# EAGLE design scout_bom (EAGLE 5.07)
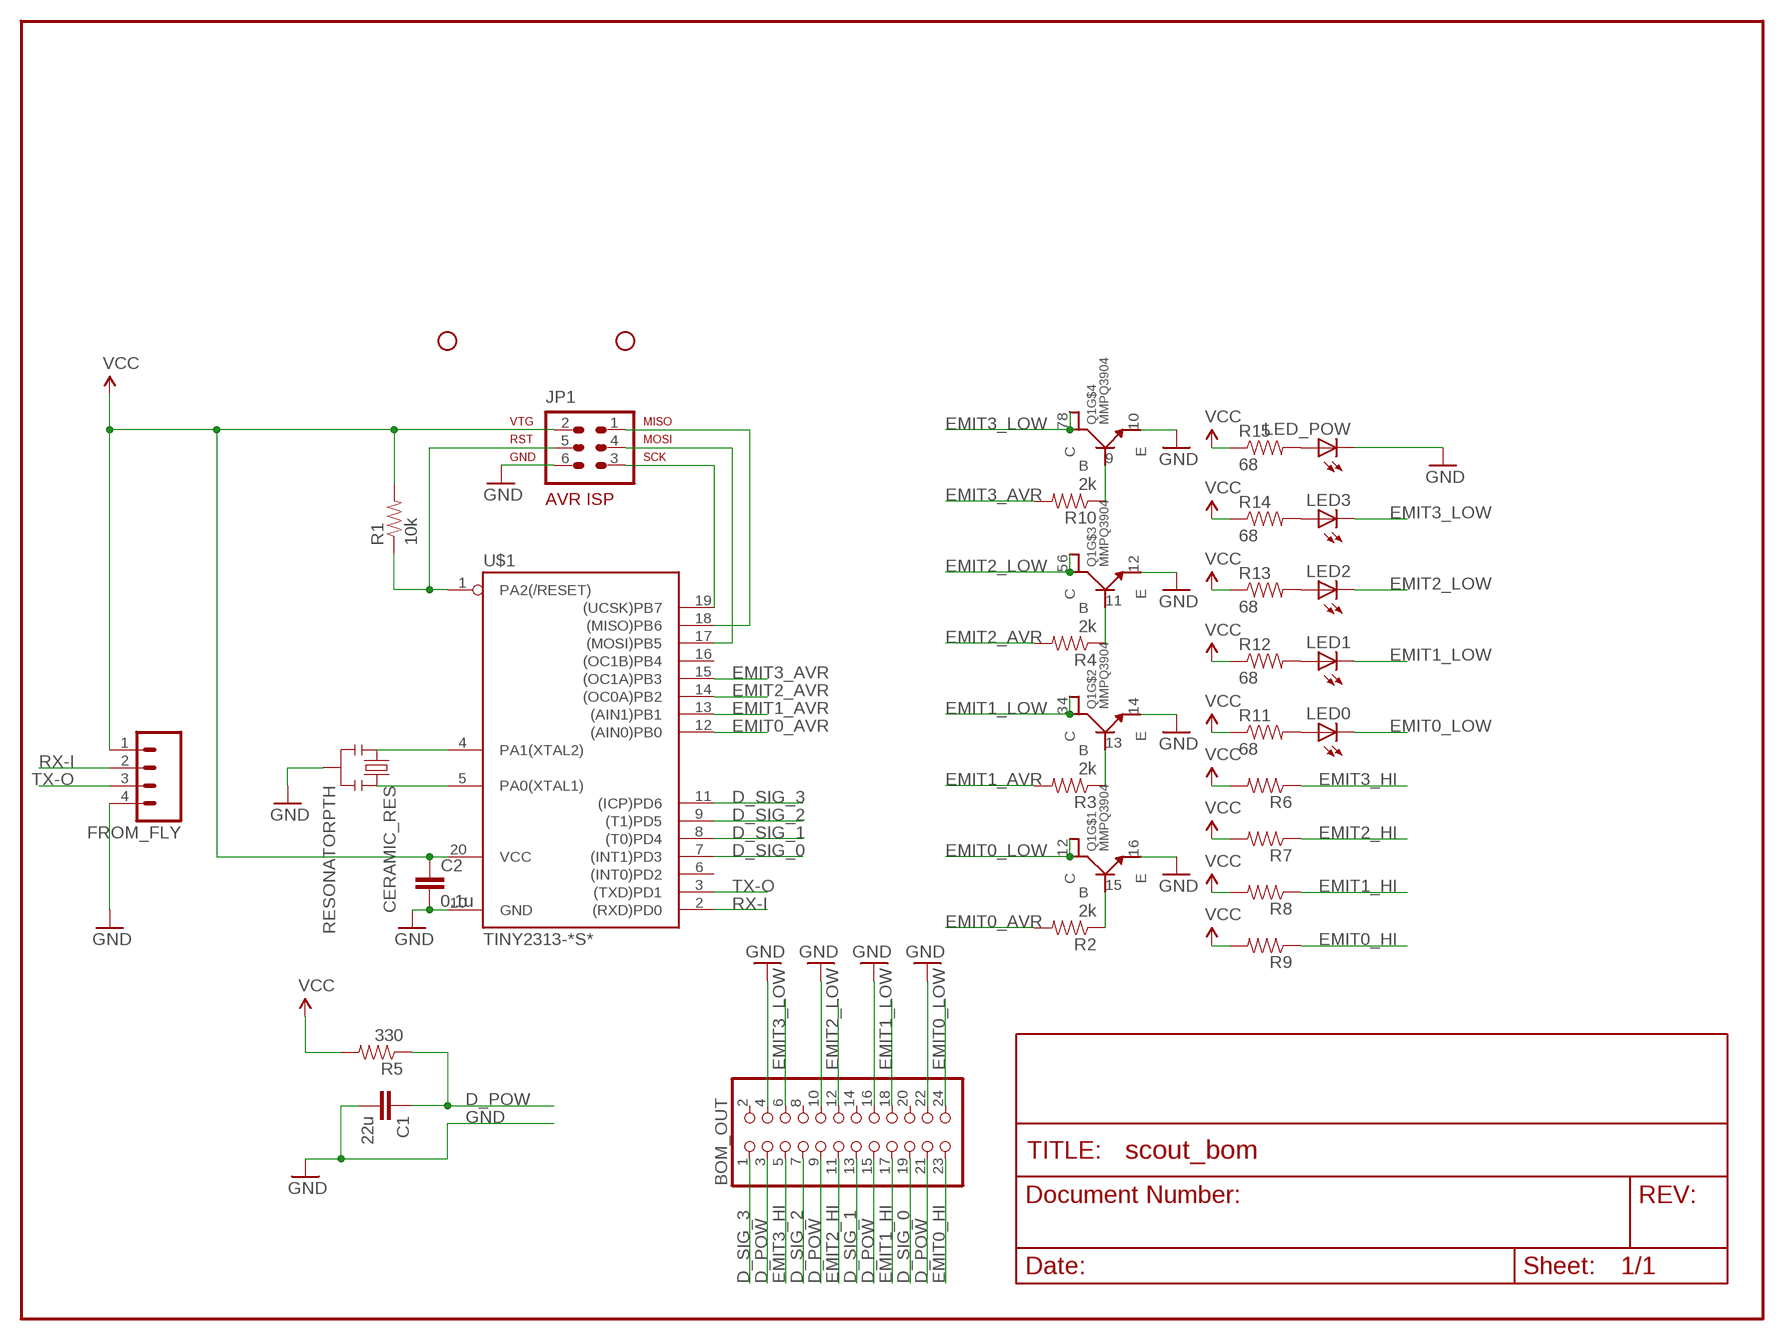
[diagram p0: schematic, sheet 1]

## Parts
BOM_OUT  PINHD-2X12/90  [2X12/90]
C1  22u  CAP0603-CAP  [0603-CAP]
C2  0.1u  CAP0603-CAP  [0603-CAP]
CERAMIC_RES  RESONATORPTH  [RESONATOR-PTH]
FROM_FLY  M04PTH  [1X04]
JP1  AVR-ISP-6  [AVR-ISP-6]
JP2  STAND-OFF  [STAND-OFF]
JP5  STAND-OFF  [STAND-OFF]
LED0  LED0603  [LED-0603]
LED1  LED0603  [LED-0603]
LED2  LED0603  [LED-0603]
LED3  LED0603  [LED-0603]
LED_POW  LED0603  [LED-0603]
Q1  MMPQ3904  [16-SOIC]
R1  10k  RESISTOR0603-RES  [0603-RES]
R2  2k  RESISTOR0603-RES  [0603-RES]
R3  2k  RESISTOR0603-RES  [0603-RES]
R4  2k  RESISTOR0603-RES  [0603-RES]
R5  330  RESISTOR0603-RES  [0603-RES]
R6  RESISTOR0603-RES  [0603-RES]
R7  RESISTOR0603-RES  [0603-RES]
R8  RESISTOR0603-RES  [0603-RES]
R9  RESISTOR0603-RES  [0603-RES]
R10  2k  RESISTOR0603-RES  [0603-RES]
R11  68  RESISTOR0603-RES  [0603-RES]
R12  68  RESISTOR0603-RES  [0603-RES]
R13  68  RESISTOR0603-RES  [0603-RES]
R14  68  RESISTOR0603-RES  [0603-RES]
R15  68  RESISTOR0603-RES  [0603-RES]
U$1  TINY2313-*S*  [SO20L$]

## Nets
D_POW: C1.1 R5.1
D_SIG_0: BOM_OUT.19 U$1.7((INT1)PD3)
D_SIG_1: BOM_OUT.13 U$1.8((T0)PD4)
D_SIG_2: BOM_OUT.7 U$1.9((T1)PD5)
D_SIG_3: BOM_OUT.1 U$1.11((ICP)PD6)
EMIT0_AVR: R2.2 U$1.12((AIN0)PB0)
EMIT0_HI: BOM_OUT.23 R9.1
EMIT0_LOW: BOM_OUT.24 LED0.C Q1.1(C) Q1.2(C1)
EMIT1_AVR: R3.2 U$1.13((AIN1)PB1)
EMIT1_HI: BOM_OUT.17 R8.1
EMIT1_LOW: BOM_OUT.18 LED1.C Q1.3(C) Q1.4(C1)
EMIT2_AVR: R4.2 U$1.14((OC0A)PB2)
EMIT2_HI: BOM_OUT.11 R7.1
EMIT2_LOW: BOM_OUT.12 LED2.C Q1.5(C) Q1.6(C1)
EMIT3_AVR: R10.2 U$1.15((OC1A)PB3)
EMIT3_HI: BOM_OUT.5 R6.1
EMIT3_LOW: BOM_OUT.6 LED3.C Q1.7(C) Q1.8(C1)
GND: BOM_OUT.22 C1.2 C2.2 CERAMIC_RES.2 FROM_FLY.4 JP1.6 LED_POW.C Q1.10(E) Q1.12(E) Q1.14(E) Q1.16(E) U$1.10(GND)
MISO: JP1.1 U$1.18((MISO)PB6)
MOSI: JP1.4 U$1.17((MOSI)PB5)
N$11: Q1.15(B) R2.1
N$12: Q1.13(B) R3.1
N$13: Q1.11(B) R4.1
N$14: Q1.9(B) R10.1
N$20: LED0.A R11.2
N$21: LED1.A R12.2
N$22: LED2.A R13.2
N$23: LED3.A R14.2
N$24: LED_POW.A R15.2
RST: JP1.5 R1.1 U$1.1(PA2(/RESET))
RX-I: FROM_FLY.2 U$1.2((RXD)PD0)
SCK: JP1.3 U$1.19((UCSK)PB7)
TX-O: FROM_FLY.3 U$1.3((TXD)PD1)
VCC: C2.1 FROM_FLY.1 JP1.2 R1.2 R5.2 R6.2 R7.2 R8.2 R9.2 R11.1 R12.1 R13.1 R14.1 R15.1 U$1.20(VCC)
XTAL1: CERAMIC_RES.3 U$1.5(PA0(XTAL1))
XTAL2: CERAMIC_RES.1 U$1.4(PA1(XTAL2))
Unconnected: BOM_OUT.2 BOM_OUT.3 BOM_OUT.4 BOM_OUT.8 BOM_OUT.9 BOM_OUT.10 BOM_OUT.14 BOM_OUT.15 BOM_OUT.16 BOM_OUT.20 BOM_OUT.21 U$1.6((INT0)PD2) U$1.16((OC1B)PB4)

## Library data of the parts
BOM_OUT = pinhead:PINHD-2X12: PIN HEADER
C1 C2 = SparkFun:CAP: Capacitor Standard 0603 ceramic capacitor, and 0.1" leaded capacitor.
CERAMIC_RES = SparkFun:RESONATOR: Resonator Small SMD resonator. This is the itty bitty 10/20MHz resonators with built in caps. CSTCE10M0G55 and CSTCE20M0V53. Footprint has been reviewed closely but hasn't been tested yet.
FROM_FLY = SparkFun:M04: Header 4 Standard 4-pin 0.1" header. Use with straight break away headers (SKU : PRT-00116), right angle break away headers (PRT-00553), swiss pins (PRT-00743), machine pins (PRT-00117), and female headers (PRT-00115). Molex polarized connector foot print use with SKU : PRT-08231 with associated crimp pins and housings.
JP1 = avr-6:AVR-ISP-6: AVR ISP-6 Serial Programming Header
JP2 JP5 = SparkFun:STAND-OFF: Stand Off This is the mechanical footprint for a #4 phillips button head screw. Use the keepout ring to avoid running the screw head into surrounding components. SKU : PRT-00447
LED0 LED1-LED3 LED_POW = SparkFun:LED: LEDs Standard schematic elements and footprints for 5mm, 3mm, 1206, and 0603 sized LEDs. 5mm - Spark Fun Electronics SKU : COM-00529 (and others)
Q1 = kwoo:MMPQ3904
R1-R15 = SparkFun:RESISTOR: Resistor Basic schematic elements and footprints for 0603, 1206, and PTH 1/10th watt (small) resistors.
U$1 = avr-6:TINY2313*: Atmel Tiny2313 2K Flash, 128 bytes EEPROM, 128 bytes RAM

## Board
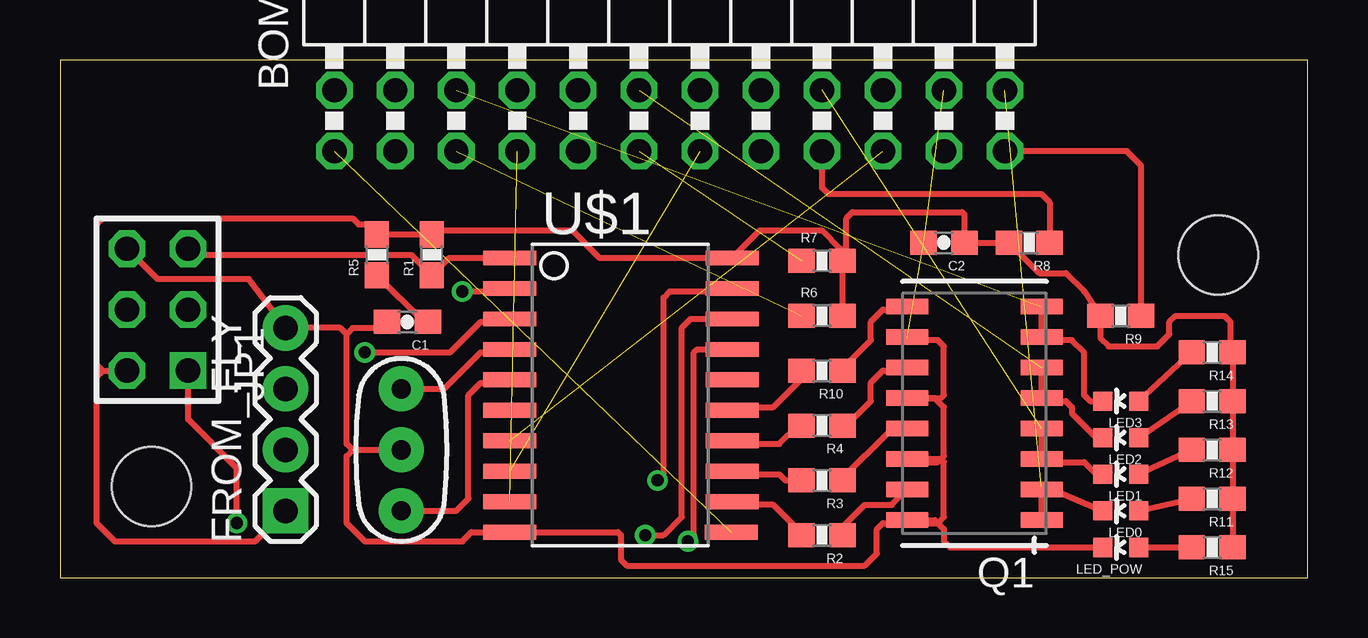
[diagram p1: board, top side]
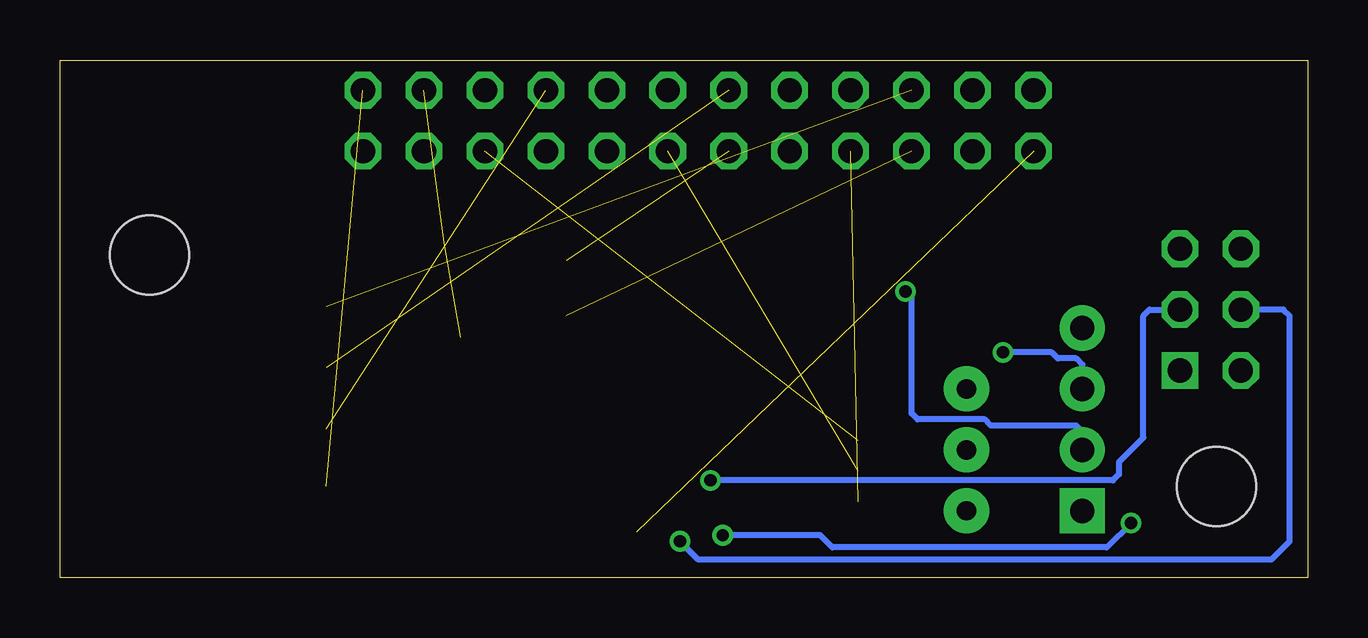
[diagram p2: board, bottom side, seen from below]

Size 51.99 x 21.58 mm. Coordinates in mm from the lower left corner, seen from the top.
Outline: 0,0 51.99,0 51.99,21.58 0,21.58 0,0
Copper layers (1*16): Top 0.035mm / dielectric 1.5mm / Bottom 0.035mm
Design rules "barebonespcb": minimum track width 6mil, minimum drill 15mil, track to track 6mil, track to pad 6mil, pad to pad 6mil, via to via 6mil, smd to smd 6mil, copper to edge 10mil, drill to drill 8mil, minimum pad ring 7mil, minimum via ring 7mil, stop-mask expansion 4mil, vias tented up to drill 0mil, thermal gap 10mil

### Footprints (pad centres in the part's own frame; a part is rotated, then mirrored left to right if it is on the bottom)
2X12/90 = drill 1.016 octagon: 1 -13.97,-6.35; 2 -13.97,-3.81; 3 -11.43,-6.35; 4 -11.43,-3.81; 5 -8.89,-6.35; 6 -8.89,-3.81; 7 -6.35,-6.35; 8 -6.35,-3.81; 9 -3.81,-6.35; 10 -3.81,-3.81; 11 -1.27,-6.35; 12 -1.27,-3.81; 13 1.27,-6.35; 14 1.27,-3.81; 15 3.81,-6.35; 16 3.81,-3.81; 17 6.35,-6.35; 18 6.35,-3.81; 19 8.89,-6.35; 20 8.89,-3.81; 21 11.43,-6.35; 22 11.43,-3.81; 23 13.97,-6.35; 24 13.97,-3.81
0603-CAP = smd 1.1 x 1: 1 -0.85,0; 2 0.85,0
RESONATOR-PTH = drill 0.8 pad 1.88 round: 1 -2.54,0; 2 0,0; 3 2.54,0
1X04 = drill 1.016 pad 1.88 square: 1 0,0 | drill 1.016 pad 1.88 round: 2 2.54,0; 3 5.08,0; 4 7.62,0
AVR-ISP-6 = drill 1.016 square: 1 -2.54,-1.27 | drill 1.016 octagon: 2 -2.54,1.27; 3 0,-1.27; 4 0,1.27; 5 2.54,-1.27; 6 2.54,1.27
STAND-OFF = hole 3.302: 0,0
LED-0603 = smd 0.8 x 0.8: A 0,-0.75; C 0,0.75
16-SOIC = smd 0.65 x 1.75: 1 -4.445,-2.8; 2 -3.175,-2.8; 3 -1.905,-2.8; 4 -0.635,-2.8; 5 0.635,-2.8; 6 1.905,-2.8; 7 3.175,-2.8; 8 4.445,-2.8; 9 4.445,2.8; 10 3.175,2.8; 11 1.905,2.8; 12 0.635,2.8; 13 -0.635,2.8; 14 -1.905,2.8; 15 -3.175,2.8; 16 -4.445,2.8
0603-RES = smd 1.1 x 1: 1 -0.85,0; 2 0.85,0
SO20L$ = smd 0.61 x 2.21: 1 -5.715,-4.636; 2 -4.445,-4.636; 3 -3.175,-4.636; 4 -1.905,-4.636; 5 -0.635,-4.636; 6 0.635,-4.636; 7 1.905,-4.636; 8 3.175,-4.636; 9 4.445,-4.636; 10 5.715,-4.636; 11 5.715,4.61; 12 4.445,4.636; 13 3.175,4.636; 14 1.905,4.636; 15 0.635,4.636; 16 -0.635,4.636; 17 -1.905,4.636; 18 -3.175,4.636; 19 -4.445,4.636; 20 -5.715,4.636

### Placement (x,y rotation side)
BOM_OUT  25.4,24.13 0 top
C1  14.48,10.67 180 top
C2  36.83,13.97 180 top
CERAMIC_RES  14.22,5.33 270 top
FROM_FLY  9.4,2.79 90 top
JP1  4.06,11.18 90 top
JP2  3.81,3.81 0 top
JP5  48.26,13.46 0 top
LED0  44.2,2.79 90 top
LED1  44.2,4.32 90 top
LED2  44.2,5.84 90 top
LED3  44.2,7.37 90 top
LED_POW  44.2,1.27 90 top
Q1  38.1,6.86 90 top
R1  15.49,13.46 90 top
R2  31.75,1.78 180 top
R3  31.75,4.06 180 top
R4  31.75,6.35 180 top
R5  13.21,13.46 90 top
R6  31.75,10.92 0 top
R7  31.75,13.21 0 top
R8  40.39,13.97 180 top
R9  44.2,10.92 180 top
R10  31.75,8.64 180 top
R11  48.01,3.3 180 top
R12  48.01,5.33 180 top
R13  48.01,7.37 180 top
R14  48.01,9.4 180 top
R15  48.01,1.27 180 top
U$1  23.37,7.62 270 top

### Tracks (layer width: path | path; a pad name or v marks a point on that pad's centre or on a via)
D_POW
  Top 0.254: C1.1 15.15,10.67 R5.1
D_SIG_0  (1 unrouted)
D_SIG_1  (1 unrouted)
D_SIG_2  (1 unrouted)
D_SIG_3  (1 unrouted)
EMIT0_AVR
  Top 0.254: R2.2 30.9,1.87 29.72,3.05 28.13,3.05 U$1.12
EMIT0_HI
  Top 0.254: R9.1 45.05,17.18 44.45,17.78 BOM_OUT.23
EMIT0_LOW  (1 unrouted)
  Top 0.254: 41.03,3.81 LED0.C | 41.03,3.81 Q1.2 Q1.1 | 41.03,3.81 40.89,3.81
EMIT1_AVR
  Top 0.254: R3.2 30.23,4.06 29.97,4.32 28.13,4.32 U$1.13
EMIT1_HI
  Top 0.254: R8.1 41.24,15.66 40.89,16 32,16 31.75,16.26 BOM_OUT.17
EMIT1_LOW  (1 unrouted)
  Top 0.254: Q1.4 Q1.3 41.03,4.83 42.67,4.83 43.18,4.32 LED1.C
EMIT2_AVR
  Top 0.254: R4.2 30.73,6.35 29.97,5.59 28.13,5.59 U$1.14
EMIT2_HI  (1 unrouted)
EMIT2_LOW  (1 unrouted)
  Top 0.254: Q1.6 Q1.5 41.03,7.37 41.91,7.37 42.16,7.11 42.16,6.86 43.18,5.84 LED2.C
EMIT3_AVR
  Top 0.254: R10.2 30.9,8.29 29.72,7.11 28.13,7.11 U$1.15
EMIT3_HI  (1 unrouted)
EMIT3_LOW  (1 unrouted)
  Top 0.254: Q1.8 Q1.7 41.03,9.91 42.16,9.91 42.67,9.4 42.67,7.62 42.93,7.37 LED3.C
GND  (2 unrouted)
  Top 0.254: Q1.10 35.43,9.91 36.58,9.91 36.83,9.65 36.83,7.62 36.7,7.49 Q1.12 36.45,7.49 36.83,7.11 36.83,5.08 36.58,4.83 35.43,4.83 Q1.14 36.7,4.95 36.83,4.83 36.83,2.54 36.58,2.29 35.43,2.29 Q1.16 | 12.19,5.33 11.94,5.08 11.94,2.29 12.7,1.52 16.76,1.52 17.14,1.91 U$1.10 23.24,1.91 23.37,1.78 23.37,0.76 23.62,0.51 33.53,0.51 34.04,1.02 34.04,2.03 34.29,2.29 35.17,2.29 Q1.16 | JP1.6 4.06,12.45 7.87,12.45 FROM_FLY.4 11.68,10.41 11.94,10.16 | Q1.16 36.45,2.41 36.83,2.03 36.83,1.52 37.08,1.27 LED_POW.C | 12.19,5.33 CERAMIC_RES.2 | 12.19,5.33 11.94,5.59 11.94,10.16 | 11.94,10.16 12.19,10.41 13.37,10.41 C1.2
MISO  (via drill 0.51)
  Top 0.254: U$1.18 26.29,10.79 25.91,10.41 25.91,2.54 25.15,1.78 v24.38,1.78 | v7.37,2.29 7.37,4.57 5.33,6.6 JP1.1
  Bottom 0.254: v7.37,2.29 8.38,1.27 19.81,1.27 20.32,1.78 v24.38,1.78
MOSI  (via drill 0.51)
  Top 0.254: U$1.17 26.54,9.53 26.42,9.4 26.42,1.78 v26.16,1.52
  Bottom 0.254: v26.16,1.52 25.4,0.76 1.52,0.76 0.76,1.52 0.76,10.92 1.02,11.18 JP1.4
N$11
  Top 0.254: R2.1 32.6,2.12 33.53,3.05 34.66,3.05 Q1.15
N$12
  Top 0.254: R3.1 32.6,4.15 34.54,6.1 35.17,6.1 Q1.13
N$13
  Top 0.254: R4.1 32.77,6.35 33.78,7.37 33.78,8.13 34.29,8.64 35.17,8.64 Q1.11
N$14
  Top 0.254: R10.1 32.6,8.72 33.78,9.91 33.78,10.67 34.29,11.18 35.17,11.18 Q1.9
N$20
  Top 0.254: LED0.A R11.2
N$21
  Top 0.254: LED1.A R12.2
N$22
  Top 0.254: LED2.A R13.2
N$23
  Top 0.254: LED3.A R14.2
N$24
  Top 0.254: LED_POW.A R15.2
RST
  Top 0.254: U$1.1 16.22,13.34 R1.1 14.64,13.46 5.59,13.46 JP1.5
RX-I  (via drill 0.51)
  Top 0.254: v16.76,11.94 18.61,11.94 U$1.2
  Bottom 0.254: v16.76,11.94 16.51,11.68 16.51,6.86 16.26,6.6 13.46,6.6 13.21,6.35 9.65,6.35 9.4,6.1 FROM_FLY.2
SCK  (via drill 0.51)
  Top 0.254: U$1.19 27.88,11.94 25.4,11.94 25.15,11.68 25.15,4.32 v24.89,4.06
  Bottom 0.254: v24.89,4.06 8.13,4.06 7.87,4.32 7.87,4.83 6.86,5.84 6.86,10.92 6.6,11.18 JP1.3
TX-O  (via drill 0.51)
  Top 0.254: v12.7,9.4 16.26,9.4 17.53,10.67 18.61,10.67 U$1.3
  Bottom 0.254: v12.7,9.4 10.67,9.4 10.41,9.14 9.65,9.14 9.4,8.89 FROM_FLY.3
VCC
  Top 0.254: R14.1 R13.1 R12.1 R11.1 R15.1 | R14.1 49.02,9.4 49.28,9.14 | R7.2 32.51,13.3 32.51,13.72 31.75,14.48 29.15,14.48 U$1.20 22.48,13.34 21.34,14.48 15.66,14.48 R1.2 R5.2 12.79,14.73 12.45,14.73 12.19,14.99 1.78,14.99 1.52,14.73 1.52,8.89 1.78,8.64 | R7.2 R6.2 | R7.2 32.77,13.37 32.77,14.99 33.02,15.24 37.59,15.24 37.68,15.15 C2.1 R8.2 40.81,12.7 41.91,12.7 42.67,11.94 R9.2 43.35,9.99 43.69,9.65 45.72,9.65 46.23,10.16 46.23,10.67 46.48,10.92 48.51,10.92 48.77,10.67 48.77,9.49 R14.1 | FROM_FLY.1 8.13,1.52 2.29,1.52 1.52,2.29 1.52,8.38 1.78,8.64 | 1.78,8.64 JP1.2
XTAL1
  Top 0.254: CERAMIC_RES.3 16.51,2.79 17.02,3.3 17.02,7.62 17.53,8.13 18.61,8.13 U$1.5
XTAL2
  Top 0.254: CERAMIC_RES.1 16,7.87 17.53,9.4 18.61,9.4 U$1.4